# Altium schematic sheet stm32_board.SchDoc
size A4
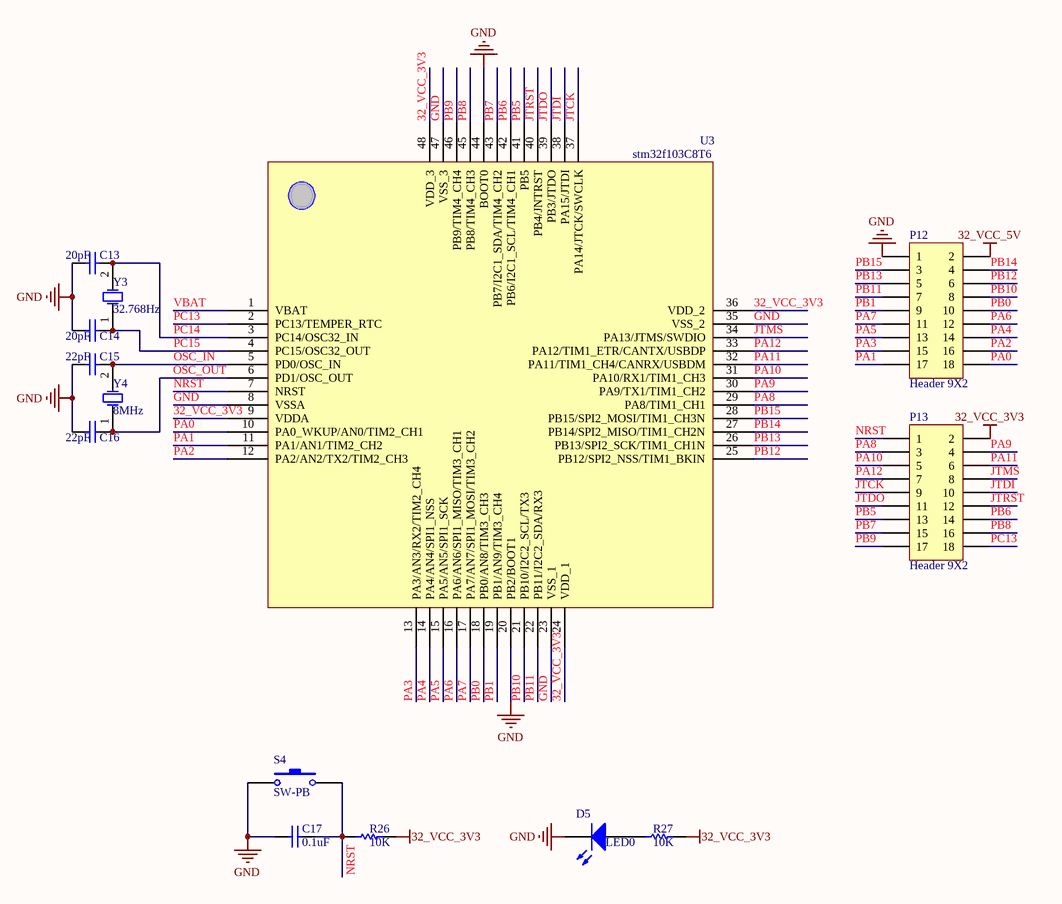
[diagram p0: stm32_board.SchDoc]

## Parts
C13  value 20pF  [6-0805_N]
C14  value 20pF  [6-0805_N]
C15  value 22pF  [6-0805_N]
C16  value 22pF  [6-0805_N]
C17  value 0.1uF  [6-0805_N]
D5  LED0  [LED]
P12  Header 9X2  [XDR2x9_S]
P13  Header 9X2  [XDR2x9_S]
R26  value 10K  [6-0805_N]
R27  value 10K  [6-0805_N]
S4  SW-PB  [SPST-2]
U3  stm32f103C8T6  [LQFP48]
Y3  32.768Hz  [HDR1X2]
Y4  8MHz  [HC-49S]

## Nets
32_VCC_3V3: P13.2 R26.2 R27.2 U3.9(VDDA) U3.24(VDD_1) U3.36(VDD_2) U3.48(VDD_3)
32_VCC_5V: P12.2
GND: C13.1 C14.1 C15.1 C16.1 C17.1 D5.2(K) P12.1 S4.1 U3.8(VSSA) U3.20(PB2/BOOT1) U3.23(VSS_1) U3.35(VSS_2) U3.44(BOOT0) U3.47(VSS_3)
JTCK: P13.9 U3.37(PA14/JTCK/SWCLK)
JTDI: P13.10 U3.38(PA15/JTDI)
JTDO: P13.11 U3.39(PB3/JTDO)
JTMS: P13.8 U3.34(PA13/JTMS/SWDIO)
JTRST: P13.12 U3.40(PB4/JNTRST)
NRST: C17.2 P13.1 R26.1 S4.2 U3.7(NRST)
OSC_IN: C15.2 U3.5(PD0/OSC_IN) Y4.2(OSC2)
OSC_OUT: C16.2 U3.6(PD1/OSC_OUT) Y4.1(OSC1)
PA0: P12.18 U3.10(PA0_WKUP/AN0/TIM2_CH1)
PA1: P12.17 U3.11(PA1/AN1/TIM2_CH2)
PA2: P12.16 U3.12(PA2/AN2/TX2/TIM2_CH3)
PA3: P12.15 U3.13(PA3/AN3/RX2/TIM2_CH4)
PA4: P12.14 U3.14(PA4/AN4/SPI1_NSS)
PA5: P12.13 U3.15(PA5/AN5/SPI1_SCK)
PA6: P12.12 U3.16(PA6/AN6/SPI1_MISO/TIM3_CH1)
PA7: P12.11 U3.17(PA7/AN7/SPI1_MOSI/TIM3_CH2)
PA8: P13.3 U3.29(PA8/TIM1_CH1)
PA9: P13.4 U3.30(PA9/TX1/TIM1_CH2)
PA10: P13.5 U3.31(PA10/RX1/TIM1_CH3)
PA11: P13.6 U3.32(PA11/TIM1_CH4/CANRX/USBDM)
PA12: P13.7 U3.33(PA12/TIM1_ETR/CANTX/USBDP)
PB0: P12.10 U3.18(PB0/AN8/TIM3_CH3)
PB1: P12.9 U3.19(PB1/AN9/TIM3_CH4)
PB5: P13.13 U3.41(PB5)
PB6: P13.14 U3.42(PB6/I2C1_SCL/TIM4_CH1)
PB7: P13.15 U3.43(PB7/I2C1_SDA/TIM4_CH2)
PB8: P13.16 U3.45(PB8/TIM4_CH3)
PB9: P13.17 U3.46(PB9/TIM4_CH4)
PB10: P12.8 U3.21(PB10/I2C2_SCL/TX3)
PB11: P12.7 U3.22(PB11/I2C2_SDA/RX3)
PB12: P12.6 U3.25(PB12/SPI2_NSS/TIM1_BKIN)
PB13: P12.5 U3.26(PB13/SPI2_SCK/TIM1_CH1N)
PB14: P12.4 U3.27(PB14/SPI2_MISO/TIM1_CH2N)
PB15: P12.3 U3.28(PB15/SPI2_MOSI/TIM1_CH3N)
PC13: P13.18 U3.2(PC13/TEMPER_RTC)
PC14: C13.2 U3.3(PC14/OSC32_IN) Y3.2(OSC2)
PC15: C14.2 U3.4(PC15/OSC32_OUT) Y3.1(OSC1)
VBAT: U3.1(VBAT)
NetD5_1: D5.1(A) R27.1

## Library data of the parts
C13-C17 = Cap: Capacitor; Published: 8-Jun-2000; LatestRevisionDate: 17-Jul-2002; LatestRevisionNote: Re-released for DXP Platform.; PackageReference: RAD-0.3; Publisher: Altium Limited; PackageDescription: Radial Cap, Thru-Hole; 2 Leads; 0.3 in Pin Spacing
D5 = LED0: Typical INFRARED GaAs LED; Published: 8-Jun-2000; LatestRevisionDate: 08-Jul-2005; LatestRevisionNote: Mech Layer 1 removed.; PackageReference: LED-0; Publisher: Altium Limited; PackageDescription: LED; 2 Leads
P12 P13 = Header 9X2: Header, 9-Pin, Dual row; LatestRevisionDate: 17-Jul-2002; LatestRevisionNote: Re-released for DXP Platform.; Publisher: Altium Limited
R26 R27 = Res1: Resistor; Published: 8-Jun-2000; LatestRevisionDate: 17-Jul-2002; LatestRevisionNote: Re-released for DXP Platform.; PackageReference: AXIAL-0.3; Publisher: Altium Limited; PackageDescription: Axial Device, Thru-Hole; 2 Leads; 0.3 in Pin Spacing
S4 = SW-PB: Switch; Published: 24-Mar-1999; LatestRevisionDate: 17-Jul-2002; LatestRevisionNote: Re-released for DXP Platform.; PackageReference: SPST-2; Publisher: Altium Limited; PackageDescription: Switch; 2 Leads
Y3 Y4 = XTAL: Crystal Oscillator; Published: 8-Jun-2000; LatestRevisionDate: 17-Jul-2002; LatestRevisionNote: Re-released for DXP Platform.; PackageReference: R38; Publisher: Altium Limited; PackageDescription: Crystal, Thru-Hole; 2 Leads; Body 3.1 x 8.2 mm (Dia.xH)